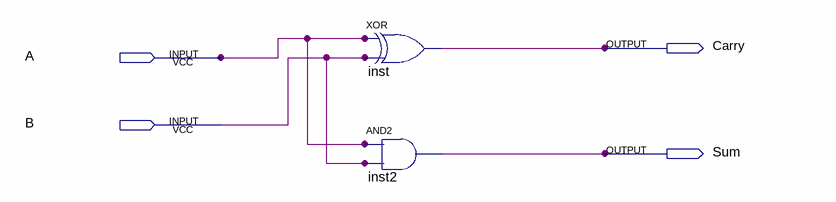
[diagram p0: schematic sheet]
// Quartus schematic Yongru_Pan_VHDL3_HA.bdf as structural Verilog: 2 symbols, 4 pins
module Yongru_Pan_VHDL3_HA (
  input  A,
  input  B,
  output Carry,
  output Sum
);

  xor inst (Carry, A, B);
  and inst2 (Sum, A, B);
endmodule
